# EAGLE board ARE_moduls (EAGLE 6.1), part 1 of 2
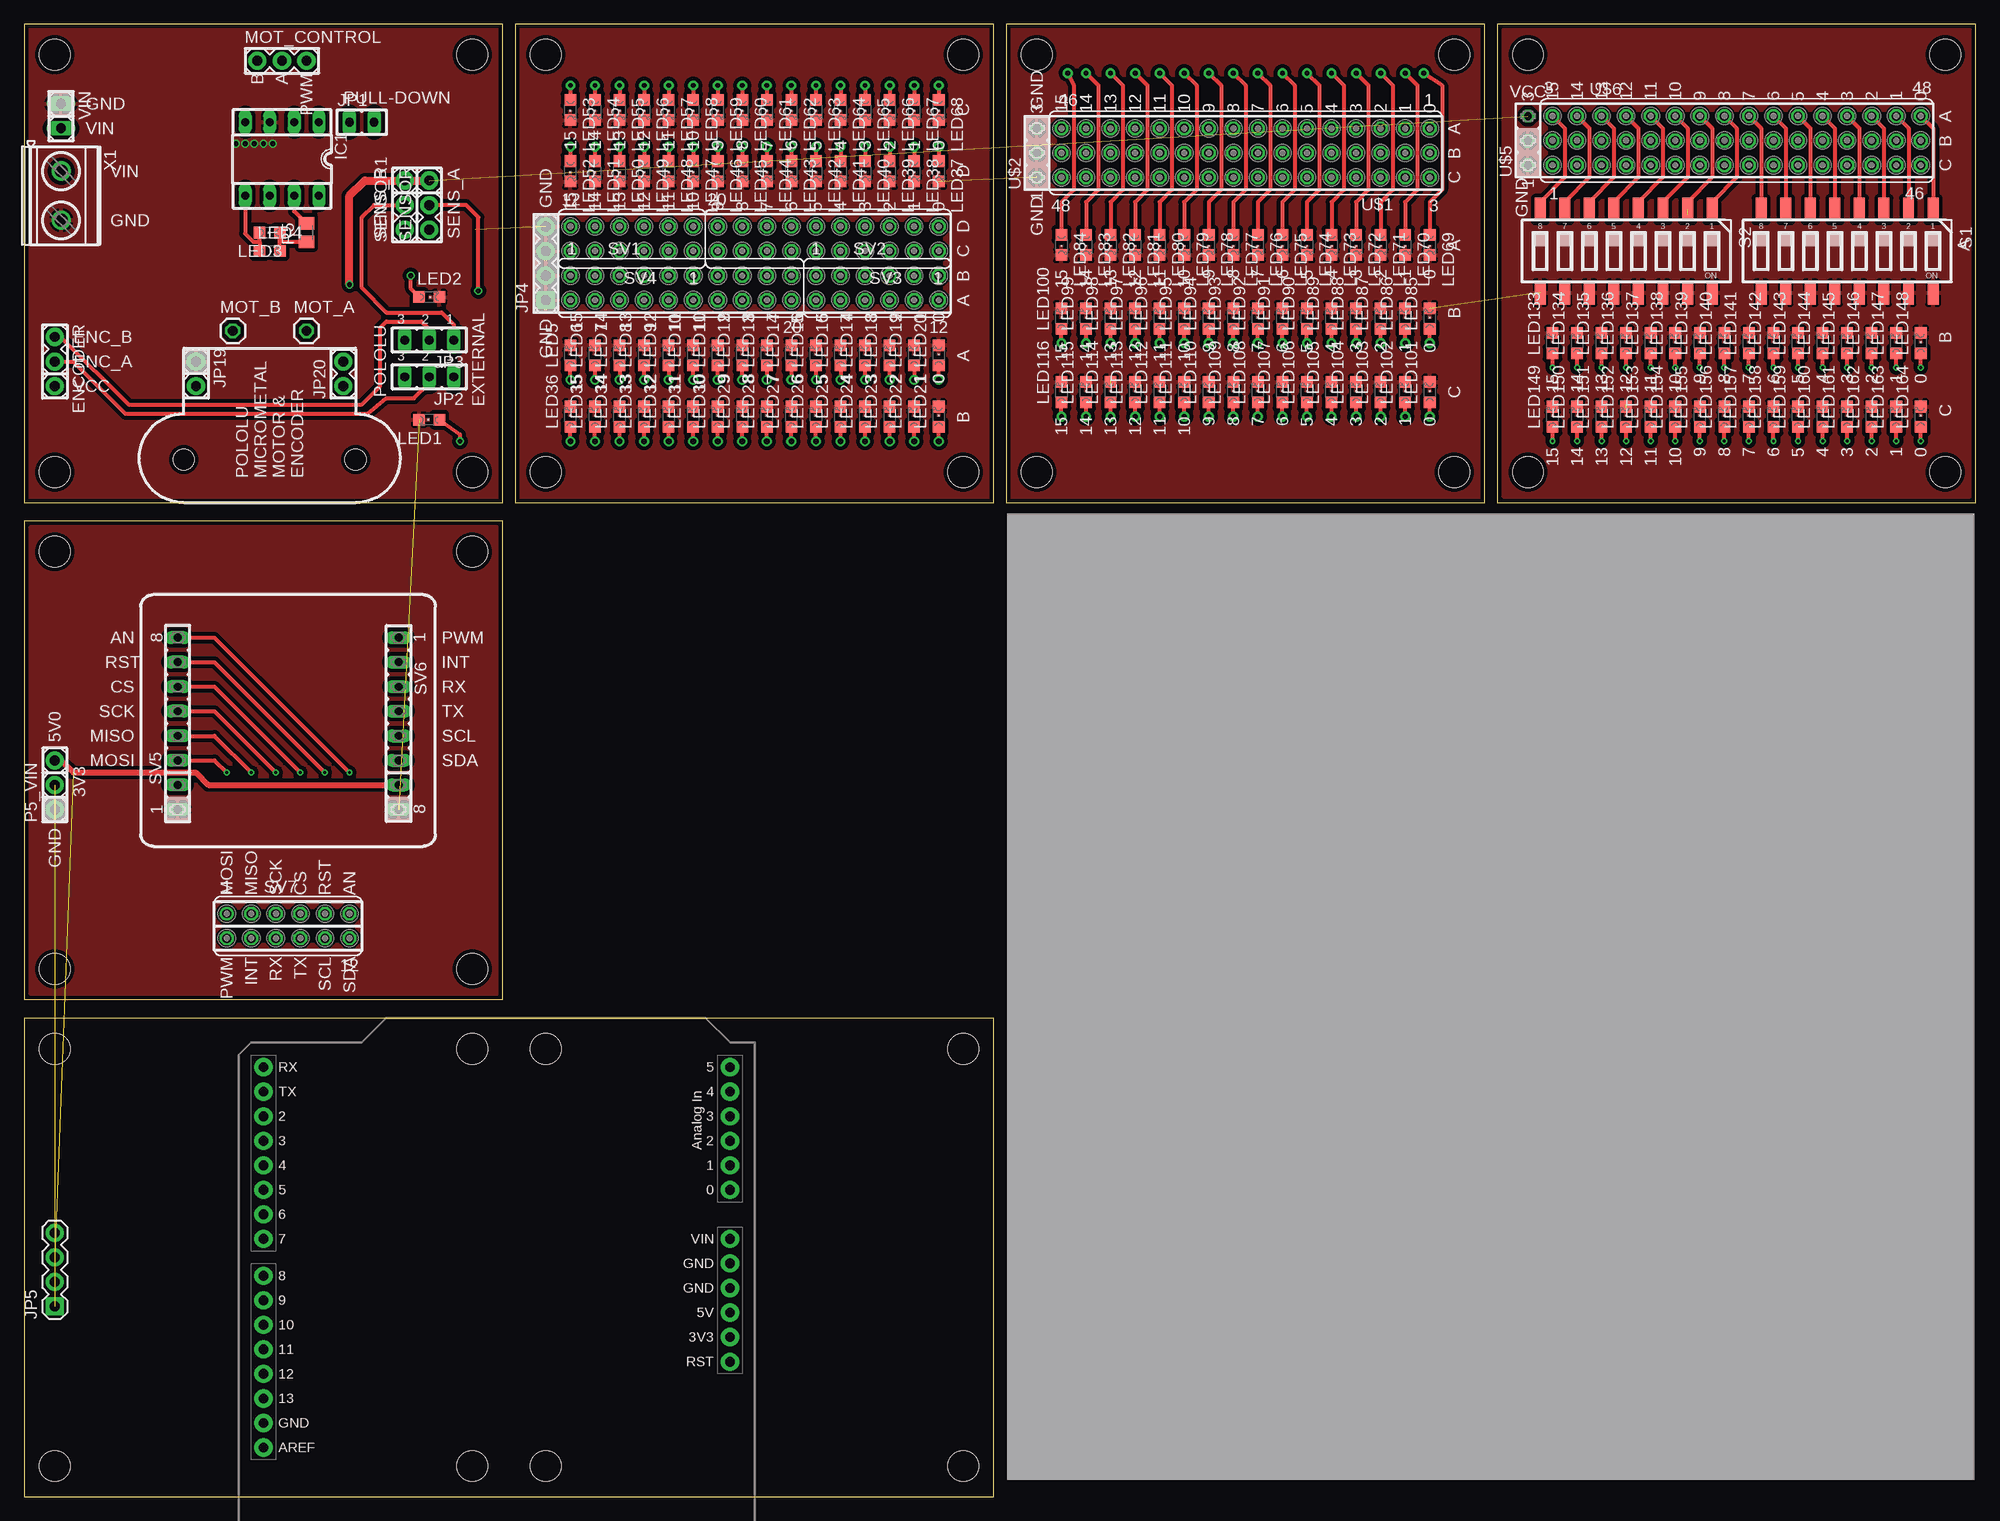
[diagram p6: board, top side]
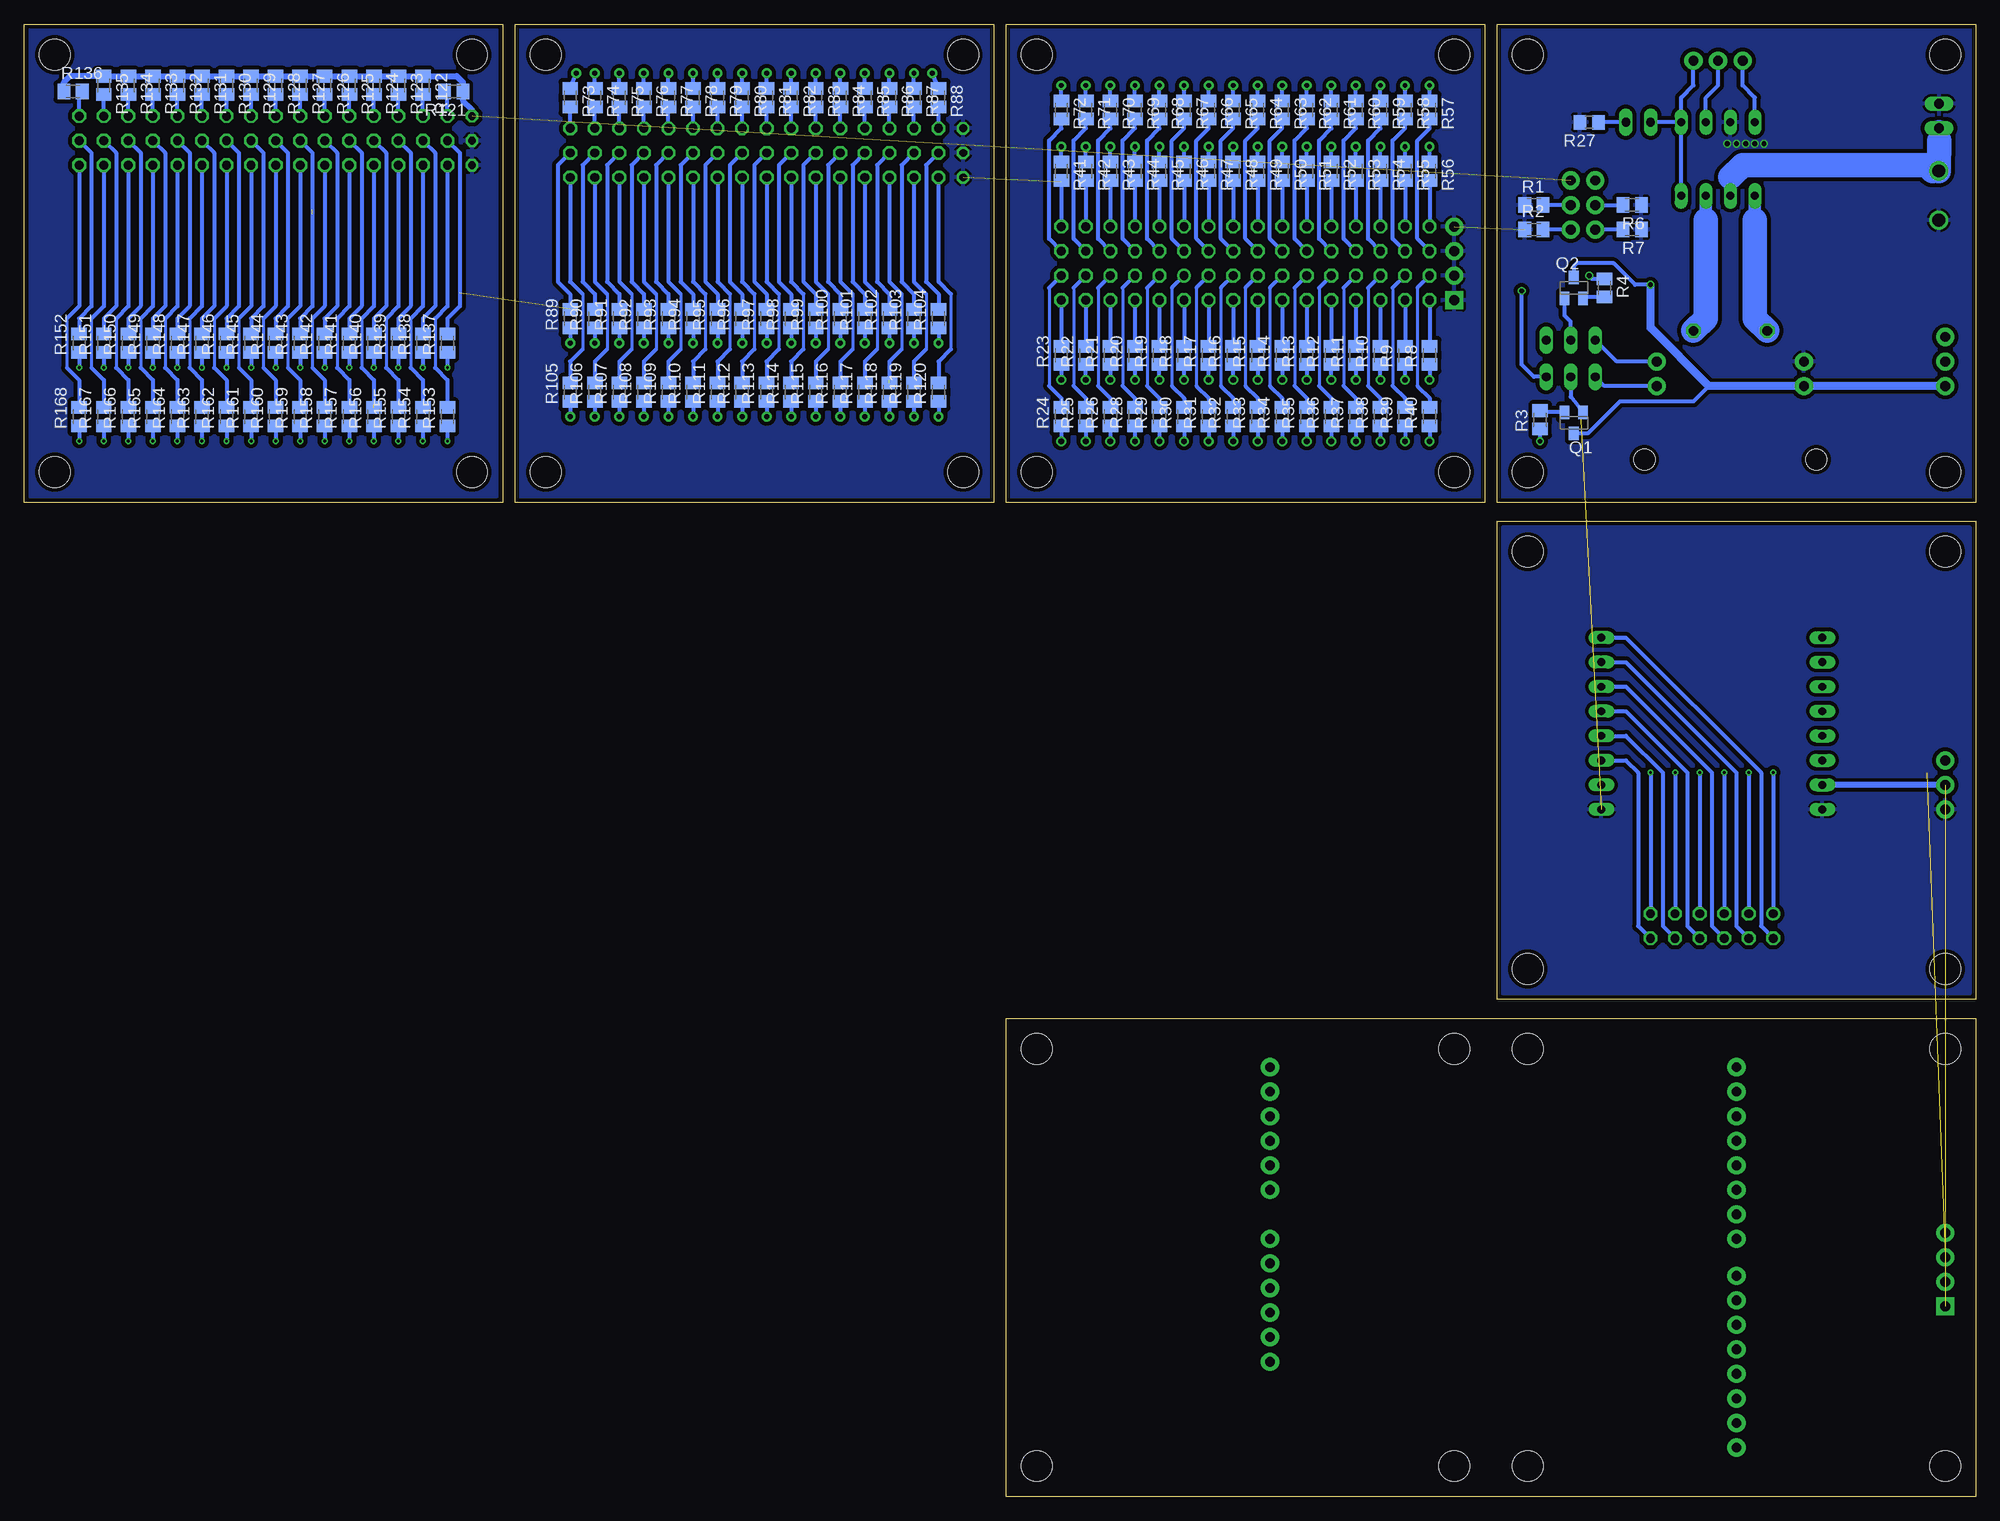
[diagram p7: board, bottom side, seen from below]

Size 201.91 x 152.39 mm. Coordinates in mm from the lower left corner, seen from the top.
Outline: 50.15,0 0,0 0,49.52 50.15,49.52
Outline: 50.16,0 100.31,0 100.31,49.52 50.16,49.52
Outline: 0,102.87 49.51,102.87 49.51,152.39 0,152.39 0,102.87
Outline: 50.8,102.87 100.31,102.87 100.31,152.39 50.8,152.39 50.8,102.87
Outline: 101.6,102.87 151.11,102.87 151.11,152.39 101.6,152.39 101.6,102.87
Outline: 152.4,102.87 201.91,102.87 201.91,152.39 152.4,152.39 152.4,102.87
Outline: 0,51.44 49.51,51.44 49.51,100.95 0,100.95 0,51.44
Copper layers (1*16): Top 0.035mm / dielectric 1.5mm / Bottom 0.035mm
Design rules: minimum track width 6mil, minimum drill 12mil, track to track 6mil, track to pad 6mil, pad to pad 6mil, via to via 6mil, smd to smd 0mil, copper to edge 10mil, drill to drill 10mil, minimum pad ring 10mil, minimum via ring 6mil, stop-mask expansion 2mil, vias tented up to drill 100mil, thermal gap 10mil
Holes 2.2 mm at 16.51,107.31 34.29,107.31
Holes 3.2 mm at 3.17,106.05 46.35,106.05 46.35,149.22 3.17,149.22 53.98,106.05 97.16,106.05 97.16,149.22 53.98,149.22 104.78,106.05 147.96,106.05 147.96,149.22 104.78,149.22 155.57,106.05 198.75,106.05 198.75,149.22 155.57,149.22 3.17,54.61 46.35,54.61 46.35,97.79 3.17,97.79 3.17,3.18 46.35,3.18 46.35,46.36 3.17,46.36 53.98,3.18 97.16,3.18 97.16,46.36 53.98,46.36

## Footprints (pad centres in the part's own frame; a part is rotated, then mirrored left to right if it is on the bottom)
1X03 = drill 1.016 pad 1.88: 1 0,0; 2 2.54,0; 3 5.08,0
SOCKET-08 = drill 0.813 long: 1 -3.81,-3.81; 2 -1.27,-3.81; 3 1.27,-3.81; 4 3.81,-3.81; 5 3.81,3.81; 6 1.27,3.81; 7 -1.27,3.81; 8 -3.81,3.81
JP1 = drill 0.914 long: 1 0,-1.27; 2 0,1.27
JP2 = drill 0.914 long: 1 -2.54,0; 2 0,0; 3 2.54,0
1X04 = drill 1.016 pad 1.88 square: 1 0,0 | drill 1.016 pad 1.88: 2 2.54,0; 3 5.08,0; 4 7.62,0
1X02 = drill 1.016 pad 1.88: 1 0,0; 2 2.54,0
CHIPLED_0805 = smd 1.2 x 1.2: A 0,-1.05; C 0,1.05
1X01 = drill 1.016 octagon: 1 0,0
SOT23 = smd 1 x 1.4: 1 -0.95,-1.1; 2 0.95,-1.1; 3 0,1.1
M0805 = smd 1.3 x 1.6: 1 -0.95,0; 2 0.95,0
R0805 = smd 1.3 x 1.5: 1 -0.95,0; 2 0.95,0
CTS-219-08 = smd 1.13 x 2.44: 1 -8.89,-4.3; 2 -6.35,-4.3; 3 -3.81,-4.3; 4 -1.27,-4.3; 5 1.27,-4.3; 6 3.81,-4.3; 7 6.35,-4.3; 8 8.89,-4.3; 9 8.89,4.3; 10 6.35,4.3; 11 3.81,4.3; 12 1.27,4.3; 13 -1.27,4.3; 14 -3.81,4.3; 15 -6.35,4.3; 16 -8.89,4.3
FE10-2 = drill 0.914 octagon: 1 -11.43,1.27; 2 -11.43,-1.27; 3 -8.89,1.27; 4 -8.89,-1.27; 5 -6.35,1.27; 6 -6.35,-1.27; 7 -3.81,1.27; 8 -3.81,-1.27; 9 -1.27,1.27; 10 -1.27,-1.27; 11 1.27,1.27; 12 1.27,-1.27; 13 3.81,1.27; 14 3.81,-1.27; 15 6.35,1.27; 16 6.35,-1.27; 17 8.89,1.27; 18 8.89,-1.27; 19 11.43,1.27; 20 11.43,-1.27
FE06-2 = drill 0.914: 1 -6.35,1.27 | drill 0.914 octagon: 2 -6.35,-1.27; 3 -3.81,1.27; 4 -3.81,-1.27; 5 -1.27,1.27; 6 -1.27,-1.27; 7 1.27,1.27; 8 1.27,-1.27; 9 3.81,1.27; 10 3.81,-1.27; 11 6.35,1.27; 12 6.35,-1.27
FE08 = drill 0.813 long: 1 -8.89,0; 2 -6.35,0; 3 -3.81,0; 4 -1.27,0; 5 1.27,0; 6 3.81,0; 7 6.35,0; 8 8.89,0
DUEMILANOVE_SHIELD_NOHOLES = drill 1.016 pad 1.88: 3.3V 50.8,26.67; 5V 50.8,29.21; A0 50.8,41.91; A1 50.8,44.45; A2 50.8,46.99; A3 50.8,49.53; A4 50.8,52.07; A5 50.8,54.61; AREF 2.54,15.24; D2 2.54,49.53; D3 2.54,46.99; D4 2.54,44.45; D5 2.54,41.91; D6 2.54,39.37; D7 2.54,36.83; D8 2.54,33.02; D9 2.54,30.48; D10 2.54,27.94; D11 2.54,25.4; D12 2.54,22.86; D13 2.54,20.32; GND@0 50.8,31.75; GND@1 50.8,34.29; GND@2 2.54,17.78; RES 50.8,24.13; RX 2.54,54.61; TX 2.54,52.07; VIN 50.8,36.83
FE16-3 = drill 0.914 octagon: 1 -19.05,-2.54; 2 -19.05,0; 3 -19.05,2.54; 4 -16.51,-2.54; 5 -16.51,0; 6 -16.51,2.54; 7 -13.97,-2.54; 8 -13.97,0; 9 -13.97,2.54; 10 -11.43,-2.54; 11 -11.43,0; 12 -11.43,2.54; 13 -8.89,-2.54; 14 -8.89,0; 15 -8.89,2.54; 16 -6.35,-2.54; 17 -6.35,0; 18 -6.35,2.54; 19 -3.81,-2.54; 20 -3.81,0; 21 -3.81,2.54; 22 -1.27,-2.54; 23 -1.27,0; 24 -1.27,2.54; 25 1.27,-2.54; 26 1.27,0; 27 1.27,2.54; 28 3.81,-2.54; 29 3.81,0; 30 3.81,2.54; 31 6.35,-2.54; 32 6.35,0; 33 6.35,2.54; 34 8.89,-2.54; 35 8.89,0; 36 8.89,2.54; 37 11.43,-2.54; 38 11.43,0; 39 11.43,2.54; 40 13.97,-2.54; 41 13.97,0; 42 13.97,2.54; 43 16.51,-2.54; 44 16.51,0; 45 16.51,2.54; 46 19.05,-2.54; 47 19.05,0; 48 19.05,2.54
FE03-1 = drill 0.813 octagon: 1 -2.54,0; 2 0,0; 3 2.54,0
1X02' = drill 1.016 long: 1 -1.27,0; 2 1.27,0
MKDSN1,5/2-5,08 = drill 1.3 pad 2: 1 -2.561,0.025; 2 2.519,0.025

## Placement (x,y rotation side)
ENCODER  [1X03]  3.17,120.02 270 top
IC1  [SOCKET-08]  26.67,138.43 180 top
JP1  [JP1]  34.92,142.24 270 top
JP2  [JP2]  41.91,115.89 180 top
JP3  [JP2]  41.91,119.7 180 top
JP4  [1X04]  53.98,123.83 90 top
JP5  [1X04]  3.17,19.69 90 top
JP19  [1X02]  17.78,117.48 270 top
JP20  [1X02]  33.02,114.94 90 top
LED1  [CHIPLED_0805]  41.91,111.44 90 top
LED2  [CHIPLED_0805]  41.91,124.14 270 top
LED3  [CHIPLED_0805]  25.4,130.81 90 top
LED4  [CHIPLED_0805]  25.4,128.91 270 top
LED5  [CHIPLED_0805]  56.52,118.11 0 top
LED6  [CHIPLED_0805]  59.05,118.11 0 top
LED7  [CHIPLED_0805]  61.59,118.11 0 top
LED8  [CHIPLED_0805]  64.14,118.11 0 top
LED9  [CHIPLED_0805]  66.67,118.11 0 top
LED10  [CHIPLED_0805]  69.22,118.11 0 top
LED11  [CHIPLED_0805]  71.75,118.11 0 top
LED12  [CHIPLED_0805]  74.3,118.11 0 top
LED13  [CHIPLED_0805]  76.83,118.11 0 top
LED14  [CHIPLED_0805]  79.38,118.11 0 top
LED15  [CHIPLED_0805]  81.92,118.11 0 top
LED16  [CHIPLED_0805]  84.45,118.11 0 top
LED17  [CHIPLED_0805]  87,118.11 0 top
LED18  [CHIPLED_0805]  89.53,118.11 0 top
LED19  [CHIPLED_0805]  92.08,118.11 0 top
LED20  [CHIPLED_0805]  94.61,118.11 0 top
LED21  [CHIPLED_0805]  94.61,111.76 0 top
LED22  [CHIPLED_0805]  92.08,111.76 0 top
LED23  [CHIPLED_0805]  89.53,111.76 0 top
LED24  [CHIPLED_0805]  87,111.76 0 top
LED25  [CHIPLED_0805]  84.45,111.76 0 top
LED26  [CHIPLED_0805]  81.92,111.76 0 top
LED27  [CHIPLED_0805]  79.38,111.76 0 top
LED28  [CHIPLED_0805]  76.83,111.76 0 top
LED29  [CHIPLED_0805]  74.3,111.76 0 top
LED30  [CHIPLED_0805]  71.75,111.76 0 top
LED31  [CHIPLED_0805]  69.22,111.76 0 top
LED32  [CHIPLED_0805]  66.67,111.76 0 top
LED33  [CHIPLED_0805]  64.14,111.76 0 top
LED34  [CHIPLED_0805]  61.59,111.76 0 top
LED35  [CHIPLED_0805]  59.05,111.76 0 top
LED36  [CHIPLED_0805]  56.52,111.76 0 top
LED37  [CHIPLED_0805]  94.61,137.16 180 top
LED38  [CHIPLED_0805]  92.08,137.16 180 top
LED39  [CHIPLED_0805]  89.53,137.16 180 top
LED40  [CHIPLED_0805]  87,137.16 180 top
LED41  [CHIPLED_0805]  84.45,137.16 180 top
LED42  [CHIPLED_0805]  81.92,137.16 180 top
LED43  [CHIPLED_0805]  79.38,137.16 180 top
LED44  [CHIPLED_0805]  76.83,137.16 180 top
LED45  [CHIPLED_0805]  74.3,137.16 180 top
LED46  [CHIPLED_0805]  71.75,137.16 180 top
LED47  [CHIPLED_0805]  69.22,137.16 180 top
LED48  [CHIPLED_0805]  66.67,137.16 180 top
LED49  [CHIPLED_0805]  64.14,137.16 180 top
LED50  [CHIPLED_0805]  61.59,137.16 180 top
LED51  [CHIPLED_0805]  59.05,137.16 180 top
LED52  [CHIPLED_0805]  56.52,137.16 180 top
LED53  [CHIPLED_0805]  56.52,143.51 180 top
LED54  [CHIPLED_0805]  59.05,143.51 180 top
LED55  [CHIPLED_0805]  61.59,143.51 180 top
LED56  [CHIPLED_0805]  64.14,143.51 180 top
LED57  [CHIPLED_0805]  66.67,143.51 180 top
LED58  [CHIPLED_0805]  69.22,143.51 180 top
LED59  [CHIPLED_0805]  71.75,143.51 180 top
LED60  [CHIPLED_0805]  74.3,143.51 180 top
LED61  [CHIPLED_0805]  76.83,143.51 180 top
LED62  [CHIPLED_0805]  79.38,143.51 180 top
LED63  [CHIPLED_0805]  81.92,143.51 180 top
LED64  [CHIPLED_0805]  84.45,143.51 180 top
LED65  [CHIPLED_0805]  87,143.51 180 top
LED66  [CHIPLED_0805]  89.53,143.51 180 top
LED67  [CHIPLED_0805]  92.08,143.51 180 top
LED68  [CHIPLED_0805]  94.61,143.51 180 top
LED69  [CHIPLED_0805]  145.41,129.54 180 top
LED70  [CHIPLED_0805]  142.88,129.54 180 top
LED71  [CHIPLED_0805]  140.34,129.54 180 top
LED72  [CHIPLED_0805]  137.79,129.54 180 top
LED73  [CHIPLED_0805]  135.25,129.54 180 top
LED74  [CHIPLED_0805]  132.72,129.54 180 top
LED75  [CHIPLED_0805]  130.18,129.54 180 top
LED76  [CHIPLED_0805]  127.64,129.54 180 top
LED77  [CHIPLED_0805]  125.09,129.54 180 top
LED78  [CHIPLED_0805]  122.56,129.54 180 top
LED79  [CHIPLED_0805]  120.02,129.54 180 top
LED80  [CHIPLED_0805]  117.47,129.54 180 top
LED81  [CHIPLED_0805]  114.94,129.54 180 top
LED82  [CHIPLED_0805]  112.39,129.54 180 top
LED83  [CHIPLED_0805]  109.86,129.54 180 top
LED84  [CHIPLED_0805]  107.31,129.54 180 top
LED85  [CHIPLED_0805]  145.41,121.92 0 top
LED86  [CHIPLED_0805]  142.88,121.92 0 top
LED87  [CHIPLED_0805]  140.34,121.92 0 top
LED88  [CHIPLED_0805]  137.79,121.92 0 top
LED89  [CHIPLED_0805]  135.25,121.92 0 top
LED90  [CHIPLED_0805]  132.72,121.92 0 top
LED91  [CHIPLED_0805]  130.18,121.92 0 top
LED92  [CHIPLED_0805]  127.64,121.92 0 top
LED93  [CHIPLED_0805]  125.09,121.92 0 top
LED94  [CHIPLED_0805]  122.56,121.92 0 top
LED95  [CHIPLED_0805]  120.02,121.92 0 top
LED96  [CHIPLED_0805]  117.47,121.92 0 top
LED97  [CHIPLED_0805]  114.94,121.92 0 top
LED98  [CHIPLED_0805]  112.39,121.92 0 top
LED99  [CHIPLED_0805]  109.86,121.92 0 top
LED100  [CHIPLED_0805]  107.31,121.92 0 top
LED101  [CHIPLED_0805]  145.41,114.3 0 top
LED102  [CHIPLED_0805]  142.88,114.3 0 top
LED103  [CHIPLED_0805]  140.34,114.3 0 top
LED104  [CHIPLED_0805]  137.79,114.3 0 top
LED105  [CHIPLED_0805]  135.25,114.3 0 top
LED106  [CHIPLED_0805]  132.72,114.3 0 top
LED107  [CHIPLED_0805]  130.18,114.3 0 top
LED108  [CHIPLED_0805]  127.64,114.3 0 top
LED109  [CHIPLED_0805]  125.09,114.3 0 top
LED110  [CHIPLED_0805]  122.56,114.3 0 top
LED111  [CHIPLED_0805]  120.02,114.3 0 top
LED112  [CHIPLED_0805]  117.47,114.3 0 top
LED113  [CHIPLED_0805]  114.94,114.3 0 top
LED114  [CHIPLED_0805]  112.39,114.3 0 top
LED115  [CHIPLED_0805]  109.86,114.3 0 top
LED116  [CHIPLED_0805]  107.31,114.3 0 top
LED133  [CHIPLED_0805]  158.12,119.38 0 top
LED134  [CHIPLED_0805]  160.66,119.38 0 top
LED135  [CHIPLED_0805]  163.19,119.38 0 top
LED136  [CHIPLED_0805]  165.74,119.38 0 top
LED137  [CHIPLED_0805]  168.28,119.38 0 top
LED138  [CHIPLED_0805]  170.81,119.38 0 top
LED139  [CHIPLED_0805]  173.35,119.38 0 top
LED140  [CHIPLED_0805]  175.9,119.38 0 top
LED141  [CHIPLED_0805]  178.44,119.38 0 top
LED142  [CHIPLED_0805]  180.97,119.38 0 top
LED143  [CHIPLED_0805]  183.51,119.38 0 top
LED144  [CHIPLED_0805]  186.06,119.38 0 top
LED145  [CHIPLED_0805]  188.59,119.38 0 top
LED146  [CHIPLED_0805]  191.13,119.38 0 top
LED147  [CHIPLED_0805]  193.68,119.38 0 top
LED148  [CHIPLED_0805]  196.22,119.38 0 top
LED149  [CHIPLED_0805]  158.12,111.76 0 top
LED150  [CHIPLED_0805]  160.66,111.76 0 top
LED151  [CHIPLED_0805]  163.19,111.76 0 top
LED152  [CHIPLED_0805]  165.74,111.76 0 top
LED153  [CHIPLED_0805]  168.28,111.76 0 top
LED154  [CHIPLED_0805]  170.81,111.76 0 top
LED155  [CHIPLED_0805]  173.35,111.76 0 top
LED156  [CHIPLED_0805]  175.9,111.76 0 top
LED157  [CHIPLED_0805]  178.44,111.76 0 top
LED158  [CHIPLED_0805]  180.97,111.76 0 top
LED159  [CHIPLED_0805]  183.51,111.76 0 top
LED160  [CHIPLED_0805]  186.06,111.76 0 top
LED161  [CHIPLED_0805]  188.59,111.76 0 top
LED162  [CHIPLED_0805]  191.13,111.76 0 top
LED163  [CHIPLED_0805]  193.68,111.76 0 top
LED164  [CHIPLED_0805]  196.22,111.76 0 top
MOT_A  [1X01]  29.21,120.65 0 top
MOT_B  [1X01]  21.59,120.65 0 top
MOT_CONTROL  [1X03]  24.13,148.59 0 top
P5_VIN  [1X03]  3.17,71.12 90 top
Q1  BSS123  [SOT23]  41.59,111.12 180 bottom
Q2  BSS123  [SOT23]  41.59,125.09 0 bottom
R1  47K  [M0805]  45.72,133.67 0 bottom
R2  330  [M0805]  45.72,131.13 0 bottom
R3  1K  [M0805]  45.09,111.44 90 bottom
R4  1K  [M0805]  38.42,125.09 270 bottom
R5  1K  [M0805]  29.21,130.81 90 top
R6  47K  [M0805]  35.56,133.67 180 bottom
R7  330  [M0805]  35.56,131.13 180 bottom
R8  1K  [M0805]  56.52,118.11 90 bottom
R9  1K  [M0805]  59.05,118.11 90 bottom
R10  1K  [M0805]  61.59,118.11 90 bottom
R11  1K  [M0805]  64.14,118.11 90 bottom
R12  1K  [M0805]  66.67,118.11 90 bottom
R13  1K  [M0805]  69.22,118.11 90 bottom
R14  1K  [M0805]  71.75,118.11 90 bottom
R15  1K  [M0805]  74.3,118.11 90 bottom
R16  1K  [M0805]  76.83,118.11 90 bottom
R17  1K  [M0805]  79.38,118.11 90 bottom
R18  1K  [M0805]  81.92,118.11 90 bottom
R19  1K  [M0805]  84.45,118.11 90 bottom
R20  1K  [M0805]  87,118.11 90 bottom
R21  1K  [M0805]  89.53,118.11 90 bottom
R22  1K  [M0805]  92.08,118.11 90 bottom
R23  1K  [M0805]  94.61,118.11 90 bottom
R24  1K  [M0805]  94.61,111.76 90 bottom
R25  1K  [M0805]  92.08,111.76 90 bottom
R26  1K  [M0805]  89.53,111.76 90 bottom
R27  4.7k  [R0805]  40.01,142.24 180 bottom
R28  1K  [M0805]  87,111.76 90 bottom
R29  1K  [M0805]  84.45,111.76 90 bottom
R30  1K  [M0805]  81.92,111.76 90 bottom
R31  1K  [M0805]  79.38,111.76 90 bottom
R32  1K  [M0805]  76.83,111.76 90 bottom
R33  1K  [M0805]  74.3,111.76 90 bottom
R34  1K  [M0805]  71.75,111.76 90 bottom
R35  1K  [M0805]  69.22,111.76 90 bottom
R36  1K  [M0805]  66.67,111.76 90 bottom
R37  1K  [M0805]  64.14,111.76 90 bottom
R38  1K  [M0805]  61.59,111.76 90 bottom
R39  1K  [M0805]  59.05,111.76 90 bottom
R40  1K  [M0805]  56.52,111.76 90 bottom
R41  1K  [M0805]  94.61,137.16 270 bottom
R42  1K  [M0805]  92.08,137.16 270 bottom
R43  1K  [M0805]  89.53,137.16 270 bottom
R44  1K  [M0805]  87,137.16 270 bottom
R45  1K  [M0805]  84.45,137.16 270 bottom
R46  1K  [M0805]  81.92,137.16 270 bottom
R47  1K  [M0805]  79.38,137.16 270 bottom
R48  1K  [M0805]  76.83,137.16 270 bottom
R49  1K  [M0805]  74.3,137.16 270 bottom
R50  1K  [M0805]  71.75,137.16 270 bottom
R51  1K  [M0805]  69.22,137.16 270 bottom
R52  1K  [M0805]  66.67,137.16 270 bottom
R53  1K  [M0805]  64.14,137.16 270 bottom
R54  1K  [M0805]  61.59,137.16 270 bottom
R55  1K  [M0805]  59.05,137.16 270 bottom
R56  1K  [M0805]  56.52,137.16 270 bottom
R57  1K  [M0805]  56.52,143.51 270 bottom
R58  1K  [M0805]  59.05,143.51 270 bottom
R59  1K  [M0805]  61.59,143.51 270 bottom
R60  1K  [M0805]  64.14,143.51 270 bottom
R61  1K  [M0805]  66.67,143.51 270 bottom
R62  1K  [M0805]  69.22,143.51 270 bottom
R63  1K  [M0805]  71.75,143.51 270 bottom
R64  1K  [M0805]  74.3,143.51 270 bottom
R65  1K  [M0805]  76.83,143.51 270 bottom
R66  1K  [M0805]  79.38,143.51 270 bottom
R67  1K  [M0805]  81.92,143.51 270 bottom
R68  1K  [M0805]  84.45,143.51 270 bottom
R69  1K  [M0805]  87,143.51 270 bottom
R70  1K  [M0805]  89.53,143.51 270 bottom
R71  1K  [M0805]  92.08,143.51 270 bottom
R72  1K  [M0805]  94.61,143.51 270 bottom
R73  1K  [M0805]  145.41,144.78 270 bottom
R74  1K  [M0805]  142.88,144.78 270 bottom
R75  1K  [M0805]  140.34,144.78 270 bottom
R76  1K  [M0805]  137.79,144.78 270 bottom
R77  1K  [M0805]  135.25,144.78 270 bottom
R78  1K  [M0805]  132.72,144.78 270 bottom
R79  1K  [M0805]  130.18,144.78 270 bottom
R80  1K  [M0805]  127.64,144.78 270 bottom
R81  1K  [M0805]  125.09,144.78 270 bottom
R82  1K  [M0805]  122.56,144.78 270 bottom
R83  1K  [M0805]  120.02,144.78 270 bottom
R84  1K  [M0805]  117.47,144.78 270 bottom
R85  1K  [M0805]  114.94,144.78 270 bottom
R86  1K  [M0805]  112.39,144.78 270 bottom
R87  1K  [M0805]  109.86,144.78 270 bottom
R88  1K  [M0805]  107.31,144.78 270 bottom
R89  1K  [M0805]  145.41,121.92 90 bottom
R90  1K  [M0805]  142.88,121.92 90 bottom
R91  1K  [M0805]  140.34,121.92 90 bottom
R92  1K  [M0805]  137.79,121.92 90 bottom
R93  1K  [M0805]  135.25,121.92 90 bottom
R94  1K  [M0805]  132.72,121.92 90 bottom
R95  1K  [M0805]  130.18,121.92 90 bottom
R96  1K  [M0805]  127.64,121.92 90 bottom
R97  1K  [M0805]  125.09,121.92 90 bottom
R98  1K  [M0805]  122.56,121.92 90 bottom
R99  1K  [M0805]  120.02,121.92 90 bottom
R100  1K  [M0805]  117.47,121.92 90 bottom
R101  1K  [M0805]  114.94,121.92 90 bottom
R102  1K  [M0805]  112.39,121.92 90 bottom
R103  1K  [M0805]  109.86,121.92 90 bottom
R104  1K  [M0805]  107.31,121.92 90 bottom
R105  1K  [M0805]  145.41,114.3 90 bottom
R106  1K  [M0805]  142.88,114.3 90 bottom
R107  1K  [M0805]  140.34,114.3 90 bottom
R108  1K  [M0805]  137.79,114.3 90 bottom
R109  1K  [M0805]  135.25,114.3 90 bottom
R110  1K  [M0805]  132.72,114.3 90 bottom
R111  1K  [M0805]  130.18,114.3 90 bottom
R112  1K  [M0805]  127.64,114.3 90 bottom
R113  1K  [M0805]  125.09,114.3 90 bottom
R114  1K  [M0805]  122.56,114.3 90 bottom
R115  1K  [M0805]  120.02,114.3 90 bottom
R116  1K  [M0805]  117.47,114.3 90 bottom
R117  1K  [M0805]  114.94,114.3 90 bottom
R118  1K  [M0805]  112.39,114.3 90 bottom
R119  1K  [M0805]  109.86,114.3 90 bottom
R120  1K  [M0805]  107.31,114.3 90 bottom
R121  1K  [M0805]  157.48,145.42 180 bottom
R122  1K  [M0805]  160.66,146.05 270 bottom
R123  1K  [M0805]  163.19,146.05 270 bottom
R124  1K  [M0805]  165.74,146.05 270 bottom
R125  1K  [M0805]  168.28,146.05 270 bottom
R126  1K  [M0805]  170.81,146.05 270 bottom
R127  1K  [M0805]  173.35,146.05 270 bottom
R128  1K  [M0805]  175.9,146.05 270 bottom
R129  1K  [M0805]  178.44,146.05 270 bottom
R130  1K  [M0805]  180.97,146.05 270 bottom
R131  1K  [M0805]  183.51,146.05 270 bottom
R132  1K  [M0805]  186.06,146.05 270 bottom
R133  1K  [M0805]  188.59,146.05 270 bottom
R134  1K  [M0805]  191.13,146.05 270 bottom
R135  1K  [M0805]  193.68,146.05 270 bottom
R136  1K  [M0805]  196.85,145.42 0 bottom
R137  1K  [M0805]  158.12,119.38 90 bottom
R138  1K  [M0805]  160.66,119.38 90 bottom
R139  1K  [M0805]  163.19,119.38 90 bottom
R140  1K  [M0805]  165.74,119.38 90 bottom
R141  1K  [M0805]  168.28,119.38 90 bottom
R142  1K  [M0805]  170.81,119.38 90 bottom
R143  1K  [M0805]  173.35,119.38 90 bottom
R144  1K  [M0805]  175.9,119.38 90 bottom
R145  1K  [M0805]  178.44,119.38 90 bottom
R146  1K  [M0805]  180.97,119.38 90 bottom
R147  1K  [M0805]  183.51,119.38 90 bottom
R148  1K  [M0805]  186.06,119.38 90 bottom
R149  1K  [M0805]  188.59,119.38 90 bottom
R150  1K  [M0805]  191.13,119.38 90 bottom
R151  1K  [M0805]  193.68,119.38 90 bottom
R152  1K  [M0805]  196.22,119.38 90 bottom
R153  1K  [M0805]  158.12,111.76 90 bottom
R154  1K  [M0805]  160.66,111.76 90 bottom
R155  1K  [M0805]  163.19,111.76 90 bottom
R156  1K  [M0805]  165.74,111.76 90 bottom
R157  1K  [M0805]  168.28,111.76 90 bottom
R158  1K  [M0805]  170.81,111.76 90 bottom
R159  1K  [M0805]  173.35,111.76 90 bottom
R160  1K  [M0805]  175.9,111.76 90 bottom
R161  1K  [M0805]  178.44,111.76 90 bottom
R162  1K  [M0805]  180.97,111.76 90 bottom
R163  1K  [M0805]  183.51,111.76 90 bottom
R164  1K  [M0805]  186.06,111.76 90 bottom
R165  1K  [M0805]  188.59,111.76 90 bottom
R166  1K  [M0805]  191.13,111.76 90 bottom
R167  1K  [M0805]  193.68,111.76 90 bottom
R168  1K  [M0805]  196.22,111.76 90 bottom
S1  219-08  [CTS-219-08]  188.59,128.91 180 top
S2  219-08  [CTS-219-08]  165.74,128.91 180 top
SENSOR  [1X03]  41.91,131.13 90 top
SENSOR1  [1X03]  39.37,131.13 90 top
SV1  [FE10-2]  67.94,125.09 0 top
SV2  [FE06-2]  88.27,125.09 0 top
SV3  [FE10-2]  83.19,130.18 180 top
SV4  [FE06-2]  62.87,130.18 180 top
SV5  [FE08]  15.88,80.01 90 top
SV6  [FE08]  38.73,80.01 270 top
SV7  [FE06-2]  27.3,59.06 0 top
U1  ARDUINO_SHIELDNOHOLES  [DUEMILANOVE_SHIELD_NOHOLES]  22.23,-10.16 0 top
U$1  FE16-3  [FE16-3]  126.36,139.06 180 top
U$2  FE03-1  [FE03-1]  104.78,139.06 90 top
U$5  FE03-1  [FE03-1]  155.57,140.34 90 top
U$6  FE16-3  [FE16-3]  177.16,140.34 0 top
VIN  [1X02']  3.81,142.88 270 top
X1  MKDSN1,5/2-5,08  [MKDSN1,5/2-5,08]  3.81,134.62 270 top